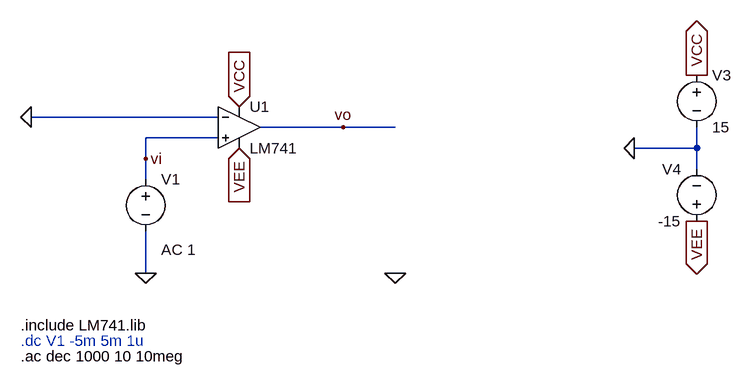
[diagram p0: schematic Lab4prelabp1.asc]
Lab4prelabp1.asc, the LTspice schematic file:
Version 4
SHEET 1 984 856
WIRE 32 48 -256 48
WIRE 224 64 96 64
WIRE 304 64 224 64
WIRE 32 80 -80 80
WIRE 768 96 768 64
WIRE 768 96 672 96
WIRE -80 112 -80 80
WIRE 768 128 768 96
WIRE -80 144 -80 112
WIRE -80 288 -80 224
FLAG 64 96 VEE
IOPIN 64 96 In
FLAG 64 32 VCC
IOPIN 64 32 In
FLAG 672 96 0
FLAG 768 -16 VCC
IOPIN 768 -16 Out
FLAG 768 208 VEE
IOPIN 768 208 Out
FLAG -256 48 0
FLAG 304 288 0
FLAG -80 288 0
FLAG 224 64 vo
FLAG -80 112 vi
SYMBOL voltage 768 -32 R0
SYMATTR InstName V3
SYMATTR Value 15
SYMBOL voltage 768 224 R180
WINDOW 0 24 96 Left 2
WINDOW 3 24 16 Left 2
SYMATTR InstName V4
SYMATTR Value -15
SYMBOL OpAmps\\opamp2 64 0 R0
SYMATTR InstName U1
SYMATTR Value LM741
SYMBOL voltage -80 128 R0
WINDOW 123 24 124 Left 2
WINDOW 39 0 0 Left 0
SYMATTR InstName V1
SYMATTR Value ""
SYMATTR Value2 AC 1
TEXT -272 368 Left 2 !.include LM741.lib
TEXT -272 392 Left 2 ;.dc V1 -5m 5m 1u
TEXT -272 416 Left 2 !.ac dec 1000 10 10meg

The netlist it stands for:
* Lab4prelabp1.asc
V3 VCC 0 15
V4 VEE 0 -15
XU1 vi 0 VCC VEE vo LM741  ; pins In+ In- V+ V- OUT
V1 vi 0 AC 1
.include LM741.lib
* .dc V1 -5m 5m 1u
.ac dec 1000 10 10meg
.backanno
.end